# EAGLE design hbridge (EAGLE 8.2.1)
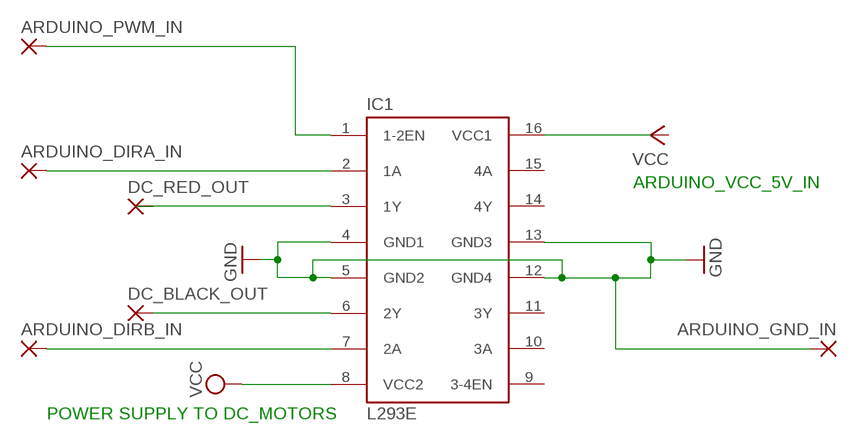
[diagram p0: schematic, sheet 1]

## Parts
ARDUINO_DIRA_IN  SMD2  [SMD1,27-2,54]
ARDUINO_DIRB_IN  SMD2  [SMD1,27-2,54]
ARDUINO_GND_IN  SMD2  [SMD1,27-2,54]
ARDUINO_PWM_IN  SMD2  [SMD1,27-2,54]
DC_BLACK_OUT  SMD2  [SMD1,27-2,54]
DC_RED_OUT  SMD2  [SMD1,27-2,54]
IC1  L293E  [DIL16]

## Nets
GND: ARDUINO_GND_IN.1(P) IC1.4(GND1) IC1.5(GND2) IC1.12(GND4) IC1.13(GND3)
N$1: ARDUINO_PWM_IN.1(P) IC1.1(1-2EN)
N$2: DC_RED_OUT.1(P) IC1.3(1Y)
N$3: DC_BLACK_OUT.1(P) IC1.6(2Y)
N$4: ARDUINO_DIRA_IN.1(P) IC1.2(1A)
N$5: ARDUINO_DIRB_IN.1(P) IC1.7(2A)
N$6: IC1.16(VCC1)
VCC: IC1.8(VCC2)
Unconnected: IC1.9(3-4EN) IC1.10(3A) IC1.11(3Y) IC1.14(4Y) IC1.15(4A)

## Notes on the sheet
- ARDUINO_VCC_5V_IN
- POWER SUPPLY TO DC_MOTORS

## Library data of the parts
ARDUINO_DIRA_IN ARDUINO_DIRB_IN ARDUINO_GND_IN ARDUINO_PWM_IN DC_BLACK_OUT DC_RED_OUT = wirepad:SMD2: SMD PAD
IC1 = texas:L293E: TI DEVICE; MF: Arrow Electronics; MPN: L293E; OC_FARNELL: 1467711; OC_NEWARK: 89K0732

## Board
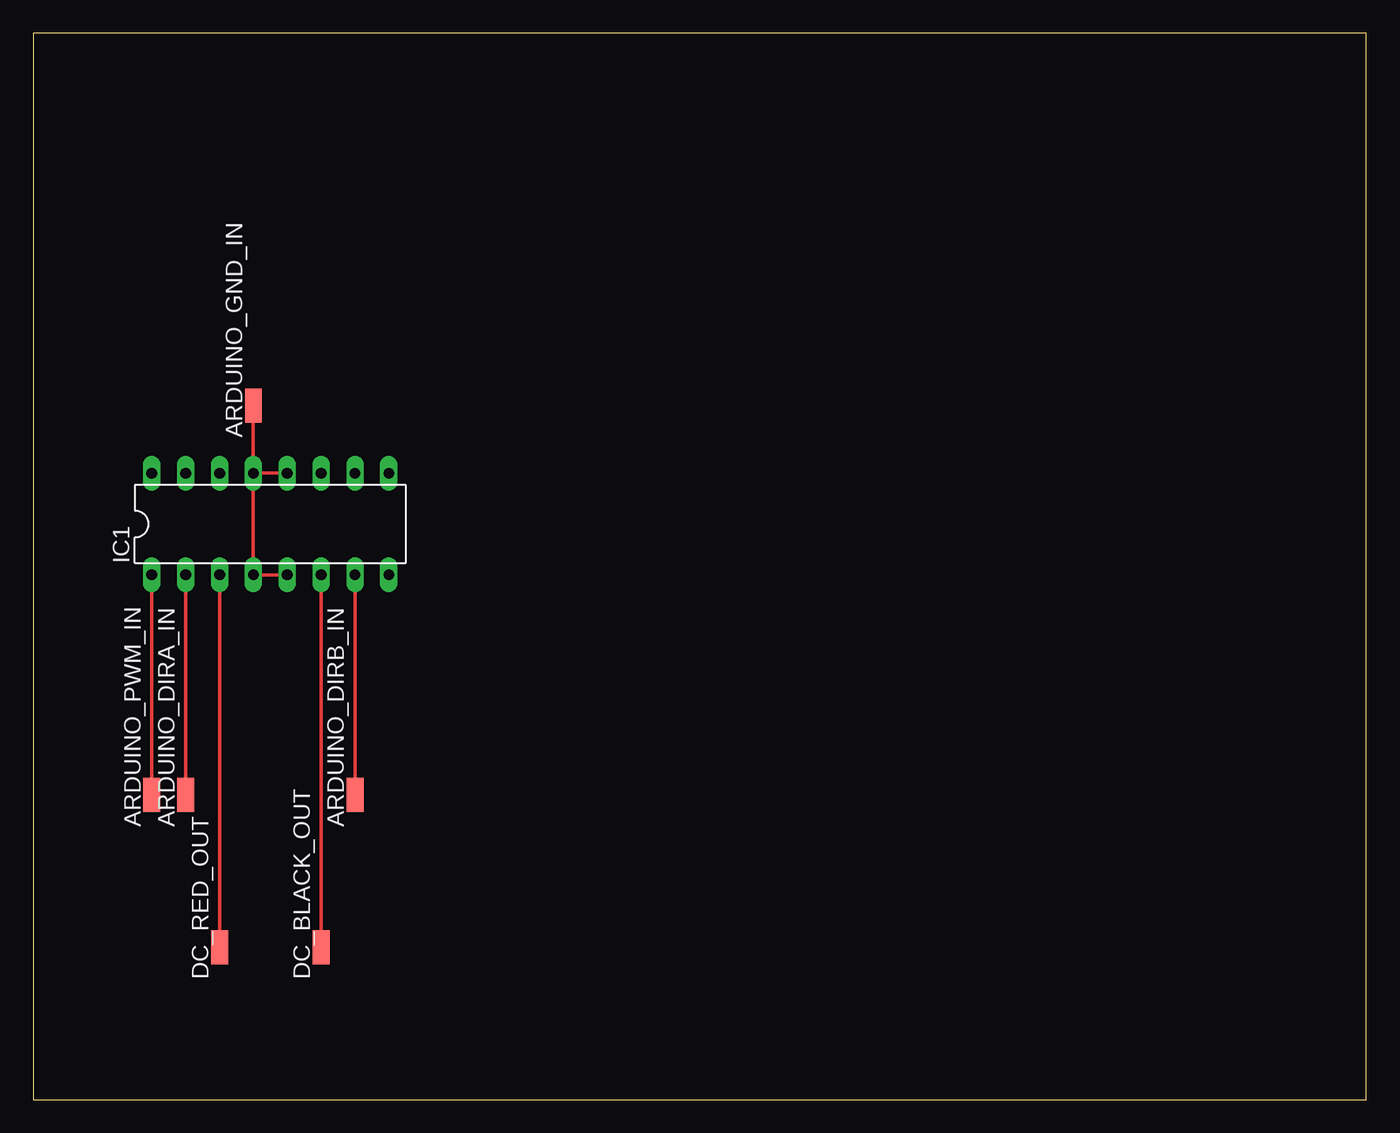
[diagram p1: board, top side]

Size 100 x 80 mm. Coordinates in mm from the lower left corner, seen from the top.
Outline: 0,0 100,0 100,80 0,80 0,0
Copper layers (1*16): Top 0.035mm / dielectric 1.5mm / Bottom 0.035mm
Design rules "default": minimum track width 10mil, minimum drill 24mil, track to track 8mil, track to pad 8mil, pad to pad 8mil, via to via 8mil, smd to smd 8mil, copper to edge 40mil, drill to drill 8mil, minimum pad ring 10mil, minimum via ring 8mil, stop-mask expansion 4mil, vias tented up to drill 0mil, thermal gap 10mil

### Footprints (pad centres in the part's own frame; a part is rotated, then mirrored left to right if it is on the bottom)
SMD1,27-2,54 = smd 1.27 x 2.54: 1 0,0
DIL16 = drill 0.813 long: 1 -8.89,-3.81; 2 -6.35,-3.81; 3 -3.81,-3.81; 4 -1.27,-3.81; 5 1.27,-3.81; 6 3.81,-3.81; 7 6.35,-3.81; 8 8.89,-3.81; 9 8.89,3.81; 10 6.35,3.81; 11 3.81,3.81; 12 1.27,3.81; 13 -1.27,3.81; 14 -3.81,3.81; 15 -6.35,3.81; 16 -8.89,3.81

### Placement (x,y rotation side)
ARDUINO_DIRA_IN  11.43,22.86 0 top
ARDUINO_DIRB_IN  24.13,22.86 0 top
ARDUINO_GND_IN  16.51,52.07 0 top
ARDUINO_PWM_IN  8.89,22.86 0 top
DC_BLACK_OUT  21.59,11.43 0 top
DC_RED_OUT  13.97,11.43 0 top
IC1  17.78,43.18 0 top

### Tracks (layer width: path | path; a pad name or v marks a point on that pad's centre or on a via)
GND
  Top 0.254: IC1.12 IC1.13 IC1.4 | IC1.4 ARDUINO_GND_IN.1 | IC1.4 IC1.5
N$1
  Top 0.254: IC1.1 ARDUINO_PWM_IN.1
N$2
  Top 0.254: IC1.3 DC_RED_OUT.1
N$3
  Top 0.254: IC1.6 DC_BLACK_OUT.1
N$4
  Top 0.254: IC1.2 ARDUINO_DIRA_IN.1
N$5
  Top 0.254: IC1.7 ARDUINO_DIRB_IN.1